# EAGLE design Schematic (EAGLE 9.2.2)
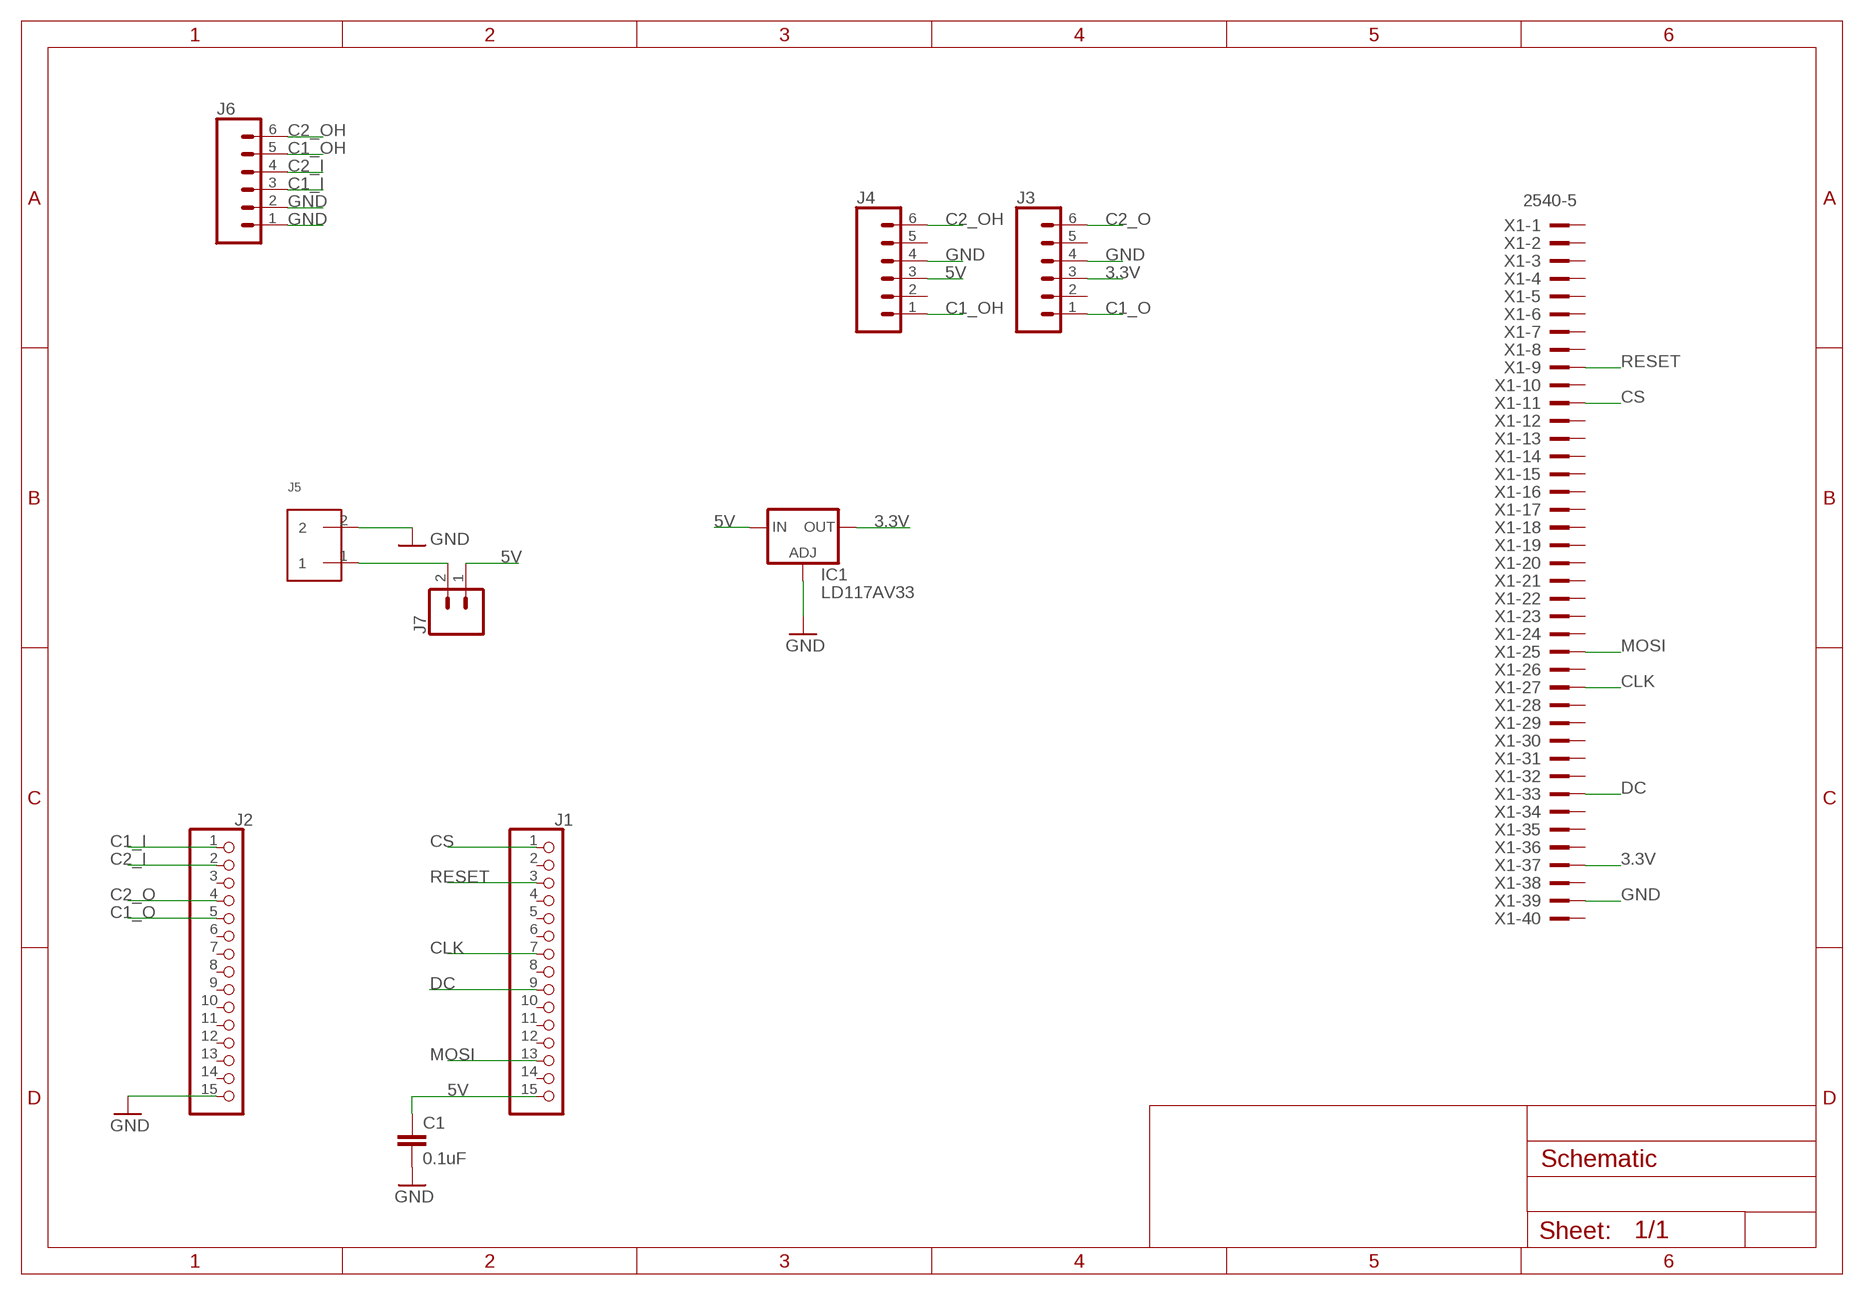
[diagram p0: schematic, sheet 1]

## Parts
C1  0.1uF  0.1UF-KIT-EZ-50V-20%  [CAP-PTH-SMALL-KIT]
IC1  LD117AV33  [TO220L1]
J1  PINHD-1X15  [1X15]
J2  PINHD-1X15  [1X15]
J3  CONN_06LONGPADS  [1X06_LONGPADS]
J4  CONN_06LONGPADS  [1X06_LONGPADS]
J5  SCREW_TERMINAL  [PHEONIX-1935161]
J6  CONN_06LONGPADS  [1X06_LONGPADS]
J7  CONN_02  [1X02]
X1  2540-5  [PAK100/2500-5-40]

## Nets
3.3V: IC1.2(OUT) J3.3 X1.37
5V: C1.1 IC1.3(IN) J1.15 J4.3 J7.1
C1_I: J2.1 J6.3
C1_O: J2.5 J3.1
C1_OH: J4.1 J6.5
C2_I: J2.2 J6.4
C2_O: J2.4 J3.6
C2_OH: J4.6 J6.6
CLK: J1.7 X1.27
CS: J1.1 X1.11
DC: J1.9 X1.33
GND: C1.2 IC1.1(ADJ) J2.15 J3.4 J4.4 J5.2 J6.1 J6.2 X1.39
MOSI: J1.13 X1.25
N$1: J5.1 J7.2
RESET: J1.3 X1.9
Unconnected: J1.2 J1.4 J1.5 J1.6 J1.8 J1.10 J1.11 J1.12 J1.14 J2.3 J2.6 J2.7 J2.8 J2.9 J2.10 J2.11 J2.12 J2.13 J2.14 J3.2 J3.5 J4.2 J4.5 X1.1 X1.2 X1.3 X1.4 X1.5 X1.6 X1.7 X1.8 X1.10 X1.12 X1.13 X1.14 X1.15 X1.16 X1.17 X1.18 X1.19 X1.20 X1.21 X1.22 X1.23 X1.24 X1.26 X1.28 X1.29 X1.30 X1.31 X1.32 X1.34 X1.35 X1.36 X1.38 X1.40

## Library data of the parts
C1 = SparkFun-Capacitors:0.1UF: 0.1µF ceramic capacitors A capacitor is a passive two-terminal electrical component used to store electrical energy temporarily in an electric field.; PROD_ID: CAP-08370
IC1 = v-reg:LD117A?*: Low drop fixed and adjustable positive voltage regulators 1 A Source: http://www.st.com/stonline/products/literature/ds/7194/ld1117axx.pdf
J1 J2 = pinhead:PINHD-1X15: PIN HEADER
J3 J4 J6 = SparkFun-Connectors:CONN_06: Multi connection point. Often used as Generic Header-pin footprint for 0.1 inch spaced/style header connections On any of the 0.1 inch spaced packages, you can populate with these: Break Away Headers - Straight <https://www.sparkfun.com/products/116> (PRT-00116) Break Away Male Headers - Right Angle <https://www.sparkfun.com/products/553> (PRT-00553) Female Headers <https://www.sparkfun.com/products/115> (PRT-00115) Break Away Headers - Machine Pin <https://www.sparkfun.com/products/117> (PRT-00117) Break Away Female Headers - Swiss Machine Pin <https://www.sparkfun.com/products/743> (PRT-00743) Arduino Stackable Header - 6 Pin <https://www.sparkfun.com/products/9280> (PRT-09280) For SCREWTERMINALS and SPRING TERMINALS visit here: Screw Terimnals on SparkFun.com <https://www.sparkfun.com/search/results?term=Screw+Terminals> (5mm/3.5mm/2.54mm spacing) This device is also useful as a general connection point to wire up your design to another part of your project. Our various solder wires solder well into these plated through hole pads. Hook-Up Wire - Assortment (Stranded, 22 AWG) <https://www.sparkfun.com/products/11375> (PRT-11375) Hook-Up Wire - Assortment (Solid Core, 22 AWG) <https://www.sparkfun.com/products/11367> (PRT-11367) View the entire wire category on our website here <https://www.sparkfun.com/categories/141>
J5 = connector:SCREW_TERMINAL: PCB terminal block 5mm; DIGIKEY: 277-1667-ND
J7 = SparkFun-Connectors:CONN_02: Multi connection point. Often used as Generic Header-pin footprint for 0.1 inch spaced/style header connections On any of the 0.1 inch spaced packages, you can populate with these: Break Away Headers - Straight <https://www.sparkfun.com/products/116> (PRT-00116) Break Away Male Headers - Right Angle <https://www.sparkfun.com/products/553> (PRT-00553) Female Headers <https://www.sparkfun.com/products/115> (PRT-00115) Break Away Headers - Machine Pin <https://www.sparkfun.com/products/117> (PRT-00117) Break Away Female Headers - Swiss Machine Pin <https://www.sparkfun.com/products/743> (PRT-00743) For SCREWTERMINALS and SPRING TERMINALS visit here: Screw Terimnals on SparkFun.com <https://www.sparkfun.com/search/results?term=Screw+Terminals> (5mm/3.5mm/2.54mm spacing) This device is also useful as a general connection point to wire up your design to another part of your project. Our various solder wires solder well into these plated through hole pads. Hook-Up Wire - Assortment (Stranded, 22 AWG) <https://www.sparkfun.com/products/11375> (PRT-11375) Hook-Up Wire - Assortment (Solid Core, 22 AWG) <https://www.sparkfun.com/products/11367> (PRT-11367) View the entire wire category on our website here <https://www.sparkfun.com/categories/141> Special notes: Molex polarized connector foot print use with: PRT-08233 with associated crimp pins and housings. 2.54_SCREWTERM for use with PRT-10571. 3.5mm Screw Terminal footprints for PRT-08084 5mm Screw Terminal footprints for use with PRT-08432
X1 = con-3m:2540-: 3M (TM) Pak 100 4-Wall Header Source: 3M; OC_FARNELL: 9838414; OC_NEWARK: unknown

## Net classes
0 default: width 0.5 mm, clearance 0.025 mm

## Board
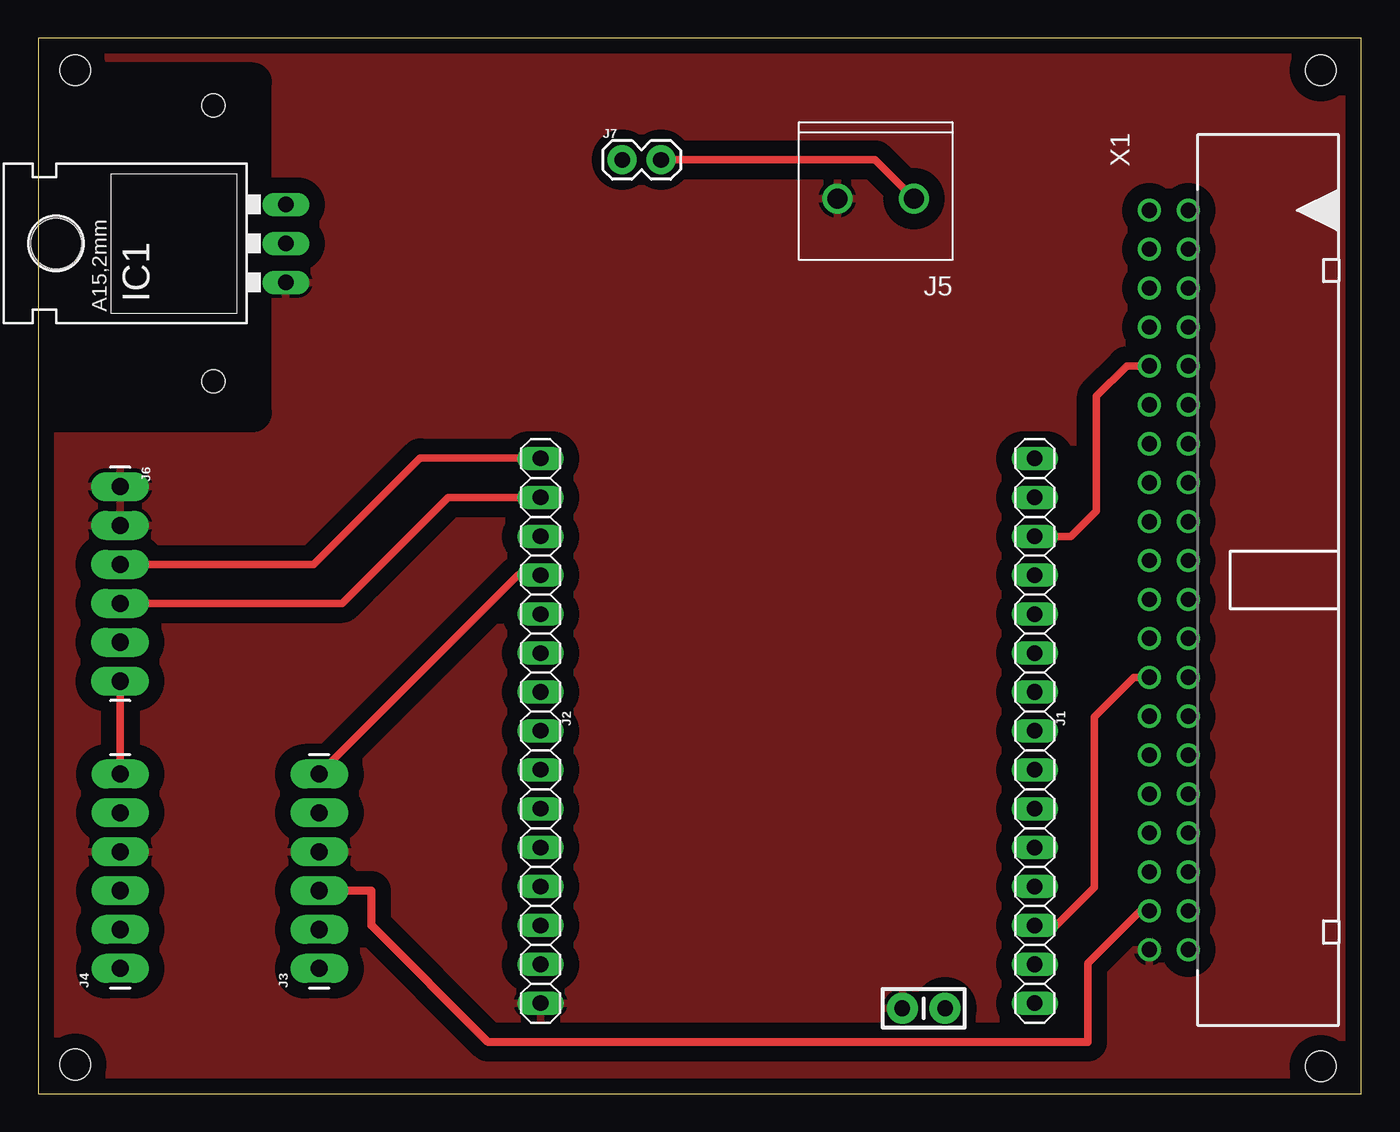
[diagram p1: board, top side]
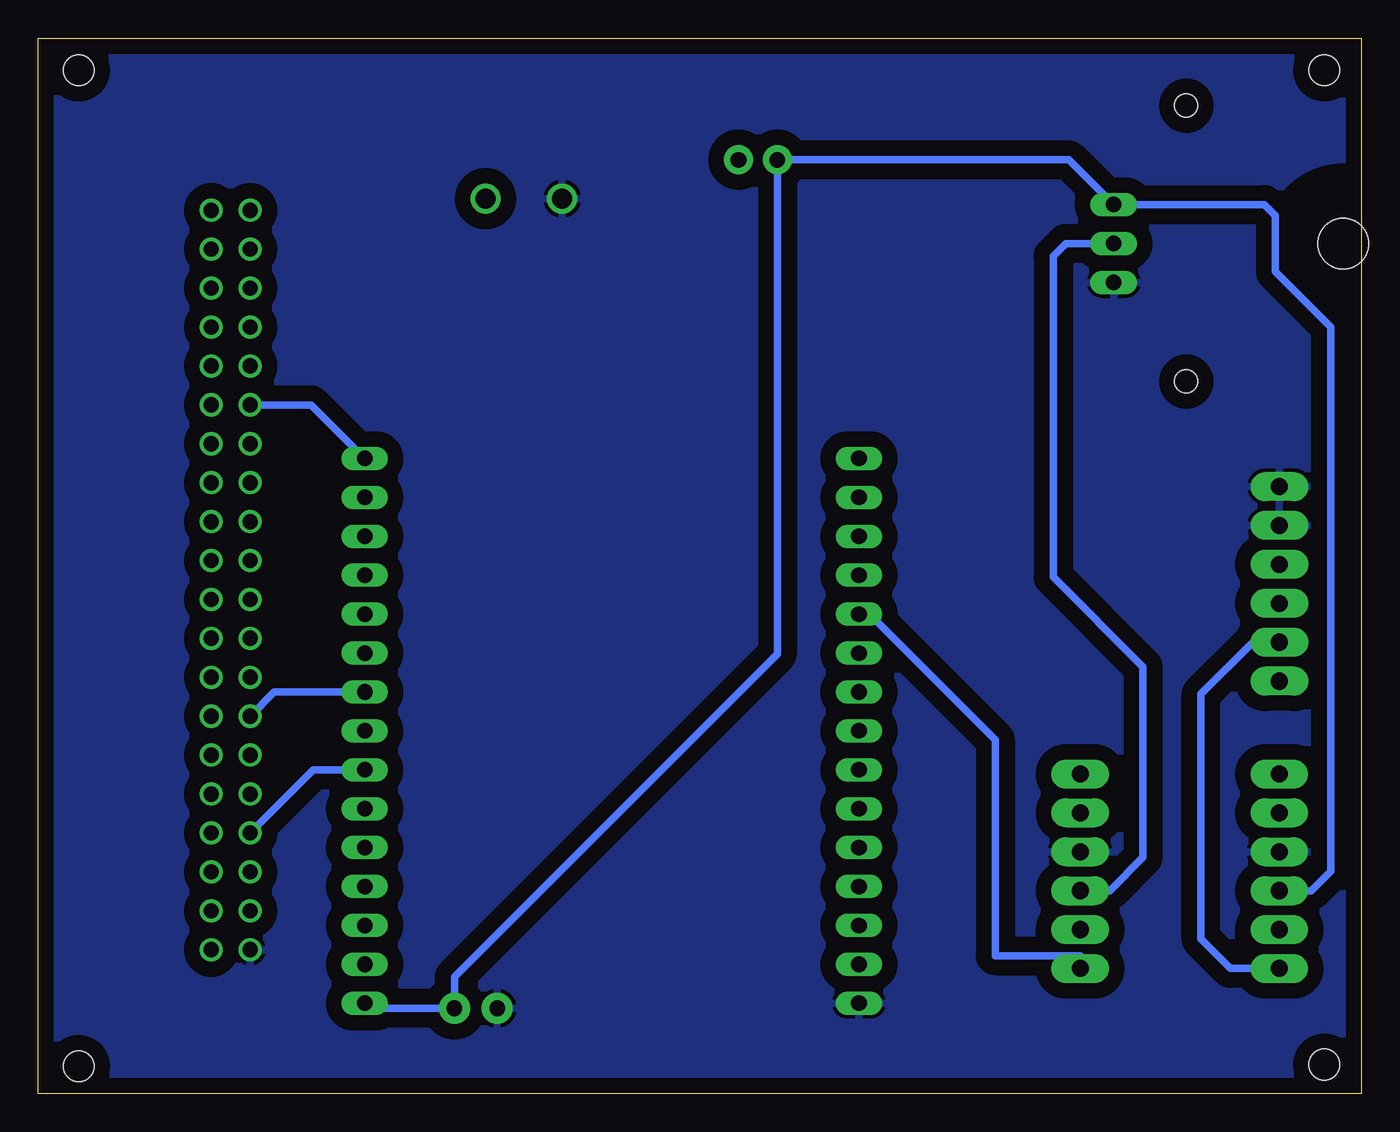
[diagram p2: board, bottom side, seen from below]

Size 86.34 x 68.89 mm. Coordinates in mm from the lower left corner, seen from the top.
Outline: 0,0 86.34,0 86.34,68.89 0,68.89 0,0
Copper layers (1*16): Top 0.035mm / dielectric 1.5mm / Bottom 0.035mm
Design rules "default *": minimum track width 16mil, minimum drill 0.35mm, track to track 16mil, track to pad 16mil, pad to pad 6mil, via to via 6mil, smd to smd 6mil, copper to edge 40mil, drill to drill 6mil, minimum pad ring 10mil, minimum via ring 8mil, stop-mask expansion 4mil, vias tented up to drill 0mil, thermal gap 10mil
Holes 1.5 mm at 11.42,64.49 11.42,46.49
Holes 2 mm at 83.69,66.8 2.41,66.8 2.41,1.91 83.69,1.78
tRestrict: area 0,44.5 to 14,66

### Footprints (pad centres in the part's own frame; a part is rotated, then mirrored left to right if it is on the bottom)
CAP-PTH-SMALL-KIT = drill 1.016 pad 2.032: 1 -1.397,0; 2 1.397,0
TO220L1 = drill 1.016 long: 1 -2.54,-3.81; 2 0,-3.81; 3 2.54,-3.81 | hole 3.302: 0,11.176
1X15 = drill 1.016 long: 1 -17.78,0; 2 -15.24,0; 3 -12.7,0; 4 -10.16,0; 5 -7.62,0; 6 -5.08,0; 7 -2.54,0; 8 0,0; 9 2.54,0; 10 5.08,0; 11 7.62,0; 12 10.16,0; 13 12.7,0; 14 15.24,0; 15 17.78,0
1X06_LONGPADS = drill 1.118 pad 1.88 long: 1 0,0; 2 2.54,0; 3 5.08,0; 4 7.62,0; 5 10.16,0; 6 12.7,0
PHEONIX-1935161 = drill 1.3: 1 0,0; 2 5,0
1X02 = drill 1.016 pad 1.88: 1 0,0; 2 2.54,0
PAK100/2500-5-40 = drill 1 pad 1.422: 1 -24.13,-1.27; 2 -24.13,1.27; 3 -21.59,-1.27; 4 -21.59,1.27; 5 -19.05,-1.27; 6 -19.05,1.27; 7 -16.51,-1.27; 8 -16.51,1.27; 9 -13.97,-1.27; 10 -13.97,1.27; 11 -11.43,-1.27; 12 -11.43,1.27; 13 -8.89,-1.27; 14 -8.89,1.27; 15 -6.35,-1.27; 16 -6.35,1.27; 17 -3.81,-1.27; 18 -3.81,1.27; 19 -1.27,-1.27; 20 -1.27,1.27; 21 1.27,-1.27; 22 1.27,1.27; 23 3.81,-1.27; 24 3.81,1.27; 25 6.35,-1.27; 26 6.35,1.27; 27 8.89,-1.27; 28 8.89,1.27; 29 11.43,-1.27; 30 11.43,1.27; 31 13.97,-1.27; 32 13.97,1.27; 33 16.51,-1.27; 34 16.51,1.27; 35 19.05,-1.27; 36 19.05,1.27; 37 21.59,-1.27; 38 21.59,1.27; 39 24.13,-1.27; 40 24.13,1.27

### Placement (x,y rotation side)
C1  57.78,5.57 180 top
IC1  12.34,55.49 90 top
J1  65.04,23.68 270 top
J2  32.78,23.68 270 top
J3  18.34,8.17 90 top
J4  5.34,8.17 90 top
J5  57.15,58.42 180 top
J6  5.33,39.62 270 top
J7  38.1,60.96 0 top
X1  73.79,33.53 270 top

### Tracks (layer width: path | path; a pad name or v marks a point on that pad's centre or on a via)
3.3V
  Top 0.5: 68.5,3.36 68.5,8.5 71.94,11.94 X1.37
  Top 0.508: 68.5,3.36 29.37,3.36 21.75,10.98 21.75,13.25 J3.3
  Bottom 0.5: IC1.2 19.29,55.49 20.1,54.68 20.1,33.72 14.24,27.86 14.24,15.42 16.41,13.25 J3.3
5V
  Bottom 0.5: J1.15 64.71,5.57 C1.1 59.18,7.62 38.1,28.7 J7.1 19.08,60.96 IC1.3 6.33,58.03 5.61,57.3 5.61,53.65 2,50.05 2,14.5 3.25,13.25 J4.3
C1_I
  Top 0.5: J6.3 17.96,34.54 24.92,41.5 32.74,41.5 J2.1
C1_O
  Bottom 0.5: J2.5 32.08,31.3 23.88,23.1 23.88,9 18.34,9 J3.1
C1_OH
  Bottom 0.5: J4.1 8.53,8.17 10.46,10.1 10.46,26.08 7.08,29.46 J6.5
C2_I
  Top 0.5: J6.4 19.84,32 26.76,38.92 J2.2
C2_O
  Top 0.5: J3.6 31.31,33.84 J2.4
C2_OH
  Top 0.5: J6.6 J4.6
CLK
  Bottom 0.5: J1.7 70.94,26.22 X1.27
CS
  Bottom 0.5: J1.1 68.54,44.96 X1.11
DC
  Bottom 0.5: J1.9 68.39,21.14 X1.33
GND
  pour Top (isolate 1.016): 0.16,69.4 86.52,69.4 86.52,-0.32 0.16,-0.32
  pour Bottom (isolate 1.016): 0.16,69.4 86.52,69.4 86.52,-0.3 0.16,-0.3
MOSI
  Top 0.5: J1.13 66.44,10.98 68.94,13.48 68.94,24.6 71.52,27.18 X1.25
N$1
  Top 0.5: J7.2 54.61,60.96 J5.1
RESET
  Top 0.5: J1.3 67.4,36.38 69.06,38.04 69.06,45.52 71.04,47.5 X1.9